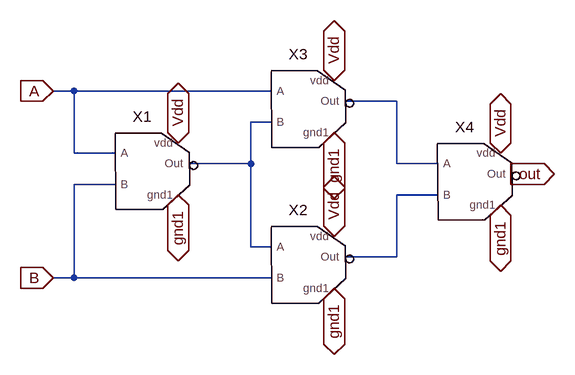
[diagram p0: schematic XORR.asc]
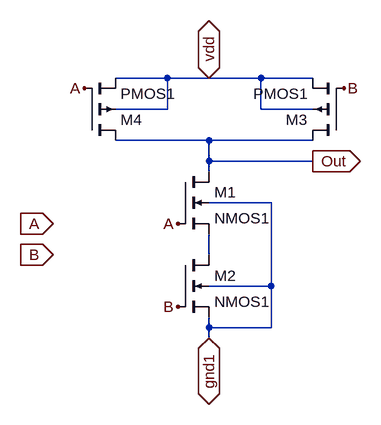
[diagram p1: sub-circuit nand.asc]
XORR.asc, the LTspice schematic file:
Version 4.1
SHEET 1 880 680
WIRE 16 64 -16 64
WIRE 320 64 16 64
WIRE 512 80 432 80
WIRE 320 112 288 112
WIRE 16 160 16 64
WIRE 80 160 16 160
WIRE 288 176 288 112
WIRE 288 176 192 176
WIRE 512 176 512 80
WIRE 576 176 512 176
WIRE 80 208 16 208
WIRE 576 224 512 224
WIRE 288 304 288 176
WIRE 320 304 288 304
WIRE 512 320 512 224
WIRE 512 320 432 320
WIRE 16 352 16 208
WIRE 16 352 -16 352
WIRE 320 352 16 352
FLAG -16 64 A
IOPIN -16 64 In
FLAG -16 352 B
IOPIN -16 352 In
FLAG 176 144 Vdd
IOPIN 176 144 BiDir
FLAG 176 224 gnd1
IOPIN 176 224 BiDir
FLAG 416 288 Vdd
IOPIN 416 288 BiDir
FLAG 416 368 gnd1
IOPIN 416 368 BiDir
FLAG 416 128 gnd1
IOPIN 416 128 BiDir
FLAG 416 48 Vdd
IOPIN 416 48 BiDir
FLAG 672 160 Vdd
IOPIN 672 160 BiDir
FLAG 672 240 gnd1
IOPIN 672 240 BiDir
FLAG 688 192 out
IOPIN 688 192 Out
SYMBOL NAND 128 192 R0
SYMATTR InstName X1
SYMBOL NAND 368 336 R0
SYMATTR InstName X2
SYMBOL NAND 368 96 R0
SYMATTR InstName X3
SYMBOL NAND 624 208 R0
SYMATTR InstName X4

nand.asc, the sub-circuit schematic file:
Version 4.1
SHEET 1 880 680
WIRE 176 0 96 0
WIRE 240 0 176 0
WIRE 320 0 240 0
WIRE 400 0 320 0
WIRE 176 48 176 0
WIRE 176 48 96 48
WIRE 320 48 320 0
WIRE 400 48 320 48
WIRE 240 96 96 96
WIRE 400 96 240 96
WIRE 240 128 240 96
WIRE 400 128 240 128
WIRE 240 144 240 128
WIRE 336 192 240 192
WIRE 240 272 240 240
WIRE 336 320 336 192
WIRE 336 320 240 320
WIRE 240 384 240 368
WIRE 336 384 336 320
WIRE 336 384 240 384
WIRE 240 400 240 384
FLAG 0 224 A
IOPIN 0 224 In
FLAG 0 272 B
IOPIN 0 272 In
FLAG 400 128 Out
IOPIN 400 128 Out
FLAG 240 400 gnd1
IOPIN 240 400 BiDir
FLAG 240 0 vdd
IOPIN 240 0 BiDir
FLAG 48 16 A
FLAG 192 224 A
FLAG 192 352 B
FLAG 448 16 B
SYMBOL nmos4 192 144 R0
SYMATTR InstName M1
SYMATTR Value2 l=1u w=2u
SYMATTR Value NMOS1
SYMBOL nmos4 192 272 R0
SYMATTR InstName M2
SYMATTR Value2 l=1u w=2u
SYMATTR Value NMOS1
SYMBOL pmos4 448 96 R180
SYMATTR InstName M3
SYMATTR Value2 l=1u w=2u
SYMATTR Value PMOS1
SYMBOL pmos4 48 96 M180
SYMATTR InstName M4
SYMATTR Value2 l=1u w=2u
SYMATTR Value PMOS1

The netlist it stands for:
* XORR.asc
X§X1 A B gnd1 N002 Vdd nand
X§X2 N002 B gnd1 N003 Vdd nand
X§X3 A N002 gnd1 N001 Vdd nand
X§X4 N001 N003 gnd1 out Vdd nand

* block symbol definitions
.subckt nand A B gnd1 Out vdd
M1 Out A N001 gnd1 NMOS1 l=1u w=2u
M2 N001 B gnd1 gnd1 NMOS1 l=1u w=2u
M3 Out B vdd vdd PMOS1 l=1u w=2u
M4 Out A vdd vdd PMOS1 l=1u w=2u
.ends nand

.model NMOS NMOS
.model PMOS PMOS
.lib standard.mos
.backanno
.end